# Altium schematic sheet FH2.54-09-22PZD.schdoc
size 127 x 101 mm
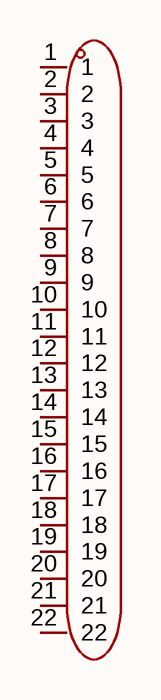
[diagram p0: FH2.54-09-22PZD.schdoc]

## Parts
U?  fh2.54-09-22pzd  [HDR-TH_22P-P2.54-V-F]  (value not drawn)

## Nets

Not connected (* = marked no-connect by the designer): U? 1 2 3 4 5 6 7 8 9 10 11 12 13 14 15 16 17 18 19 20 21 22

## Library data of the parts
U? = fh2.54-09-22pzd: Holes Structure:1x22P Pitch:2.54mm Circular Hole / Square Hole:Square Hole Mounting Type:Through Hole Number of Rows:1 Number of Positions:22P Current Rating:3A Holes Direction:Top Insulation Height:8.5mm Contact Material:Brass Contact Plating:Gold Operat; Manufacturer: XUNPU(讯普); AddInBom: yes; ModelId: 676cdefe1703484f8a37377e34cf1f64; ModelTransform: 2199.99552,98.425,0,0,0,0,0,0,-125.984; Holes Structure: 1x22P; Pitch: 2.54mm; Number of Positions: 22P; Current Rating: 3A; Holes Direction: Top; PIN Length: 3.2mm; LCSC Part Name: 1x22P 间距:2.54mm 直插; SupplierPart: C7500786; ManufacturerPart: FH2.54-09-22PZD; Supplier Footprint: 插件,P=2.54mm; JLCPCB Part Class: Extended Part; Datasheet: https://item.szlcsc.com/datasheet/FH2.54-09-22PZD/8579590.html; Supplier: LCSC; ConvertToPcb: yes; SymbolName: FH2.54-09-22PZD; FootprintName: HDR-TH_22P-P2.54-V-F; ModelName: HDR-TH_22P-P2.54-V-F; Circular Hole / Square Hole: Square Hole; Mounting Type: Through Hole; Number of Rows: 1; Insulation Height: 8.5mm; Contact Material: Brass; Contact Plating: Gold; Operating Temperature: -40℃~+105℃